# Altium schematic sheet VoltageRegulator5V.SchDoc
size A
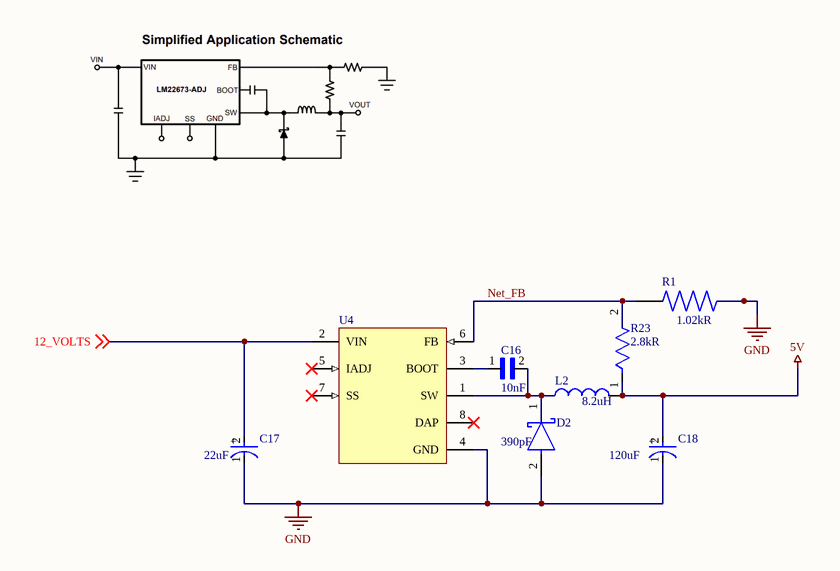
[diagram p0: VoltageRegulator5V.SchDoc]

## Parts
C16  value 10nF  [CAPC2012X100N]  (hidden comment: C0805C103F5GECAUTO)
C17  value 22uF  [FP-OS-CON-SMT-C6-MFG]  (hidden comment: 35SVF22M)
C18  Capacitance: 120uF  [FP-OS-CON-SMT-E7-MFG]  (hidden comment: 16SVPC120M)
D2  value 390pF  [FP-95401-MFG]  (hidden comment: VS-10BQ015-M3/5BT)
L2  value 8.2uH  [INDC2012X145N]  (hidden comment: CV201210-8R2K)
R1  Resistance: 1.02kR  [RESC2012X70N]  (hidden comment: ERJ-PB6B1021V)
R23  Resistance: 2.8kR  [FP-RNCP0805-MFG]  (hidden comment: RNCP0805FTD2K80)
U4  LM22673TJE-5.0/NOPB  [TJ7A_M]  (value not drawn)

## Nets
5V: C18.2(A) L2.2 R23.1
GND: C17.1(C) C18.1(C) D2.2(A) R1.2 U4.4(GND)
12_VOLTS: C17.2(A) U4.2(VIN) ; off-sheet 12_VOLTS
Net_FB: R1.1 R23.2 U4.6(FB)
NetC16_1: C16.1 U4.3(BOOT)
NetC16_2: C16.2 D2.1(C) L2.1 U4.1(SW)

Not connected (* = marked no-connect by the designer): U4 5(IADJ)* 7(SS)* 8(DAP)*

## Notes on the sheet
- (in symbol CMP-05428-000021-2) +
- (in symbol CMP-05428-000375-1) +

## Library data of the parts
C16 = C0805C103F5GECAUTO: CAP CER 0805 10NF 50V C0G 1%; Manufacturer: KEMET; Manufacturer Part Number: C0805C103F5GECAUTO7210; Package: None; Price: None; MP: C0805C103F5GECAUTO; Availability: Unavailable; Supplier 1: Digi-Key; Supplier Part Number 1: C0805C103F5GECAUTO7210-ND; RoHS: Yes; Category: Ceramic Capacitors; RoHS Compliant: Yes; ComponentLink1URL: https://api.kemet.com/component-edge/download/datasheet/C0805C103F5GECAUTO7210.pdf?src-supplier=Digi-Key; ComponentLink1Description: https://api.kemet.com/component-edge/download/datasheet/C0805C103F5GECAUTO7210.pdf?src-supplier=Digi-Key
C17 = CMP-05428-000375-1: Conductive Polymer Aluminum Solid Capacitors (OS-CON) 22uF ±20% 35V; Manufacturer: Panasonic; RoHS Compliant: Yes; Supplier 1: Arrow Electronics; Supplier Part Number 1: 35SVF22M; Manufacturer Part Number: 35SVF22M; RoHS: Yes; Category: Polymer Capacitors; Stock 1: 1750; Pricing 1: 1=0.96030, 10=0.87800, 25=0.85400, 100=0.76830, 250=0.76450, 500=0.65580, 1000=0.60660 (USD); ComponentLink1URL: http://www.farnell.com/datasheets/2283842.pdf?src-supplier=Farnell; ComponentLink1Description: http://www.farnell.com/datasheets/2283842.pdf?src-supplier=Farnell; ComponentLink2URL: https://na.industrial.panasonic.com/file-download/4311?src-supplier=Digi-Key; ComponentLink2Description: https://na.industrial.panasonic.com/file-download/4311?src-supplier=Digi-Key
C18 = CMP-05428-000021-2: Conductive Polymer Aluminum Solid Capacitors (OS-CON) 120uF ±20% 16V RADIAL SMT 8x6.9mm; Manufacturer: Panasonic; Leakage Current: 500uA; Ripple Current: 2.9A; ESR (Equivalent Series Resistance): 27mR; Polarity: Polar; Dissipation Factor: 12%; Life (Hours): 2000Hour; Lead Free: Lead Free; Voltage Rating (DC): 16V; Min Operating Temperature: -55°C; Height - Seated (Max): 0.276inch; Case/Package: Radial; REACH SVHC: No SVHC; Diameter: 8mm; Mount: Surface Mount; Package Quantity: 1000; Construction: Cylindrical; Max Operating Temperature: 105°C; Voltage: 16V; Length: 6.9mm; Tolerance: 20%; RoHS Compliant: Yes; Series: OS-CON, SVPC; Packaging: Tape and Reel; Voltage Rating: 16V; Termination: SMD/SMT; Number of Pins: 7; Ripple Current (AC): 2.9A; Height: 6.9mm; Supplier 1: RSComponents; Supplier Part Number 1: 7887618; Manufacturer Part Number: 16SVPC120M; RoHS: Yes; Category: Aluminum Electrolytic Capacitors; Stock 1: 1; Pricing 1: 2=1.66000, 10=1.54400, 20=1.42700, 50=1.19300, 100=1.02700 (USD); Reach SVHC Compliant: No; ComponentLink1URL: https://datasheet.ciiva.com/22746/1734358-22746176.pdf?src-supplier=Element14; ComponentLink1Description: https://datasheet.ciiva.com/22746/1734358-22746176.pdf?src-supplier=Element14; ComponentLink2URL: https://datasheet.ciiva.com/48542/svpc-eng-ds-48542359.pdf?src-supplier=Distrelec; ComponentLink2Description: https://datasheet.ciiva.com/48542/svpc-eng-ds-48542359.pdf?src-supplier=Distrelec; ComponentLink3URL: https://datasheet.ciiva.com/25740/1734358-25740810.pdf?src-supplier=Farnell; ComponentLink3Description: https://datasheet.ciiva.com/25740/1734358-25740810.pdf?src-supplier=Farnell
D2 = CMP-02539-000017-1: DIODE SCHOTTKY 15V 1A DO214AA; Manufacturer: Vishay; Standoff Height: 0mm; Max Surge Forward Current: 40A; Peak Reverse Current: 0.5mA; Max Junction Temp: +125°C; Max Reverse Current: 500uA; Max Forward Surge Current (Ifsm): 140A; Forward Voltage: 330mV; Element Configuration: Single; Max Repetitive Reverse Voltage: 15V; Mouser Description: VS-10BQ015 Series 15 V 1 A SMT Schottky Rectifier - SMB (DO-214AA); Device Class L1: Discrete Semiconductors; Height: 2.44mm; ComponentLink2Description: Datasheet; ComponentLink2URL: http://www.vishay.com/docs/93349/vs-10bq015m.pdf; Footprint Url: http://www.vishay.com/docs/95401/smb.pdf; Reverse Voltage: 15V; Device Class L2: Diodes; Package: 95401; Temperature Range High: +125°C; Manufacturer Part Number: VS-10BQ015-M3/5BT; Category: Diode; Device Class L3: Schottky Diodes; Temperature Range Low: -55°C; Capacitance: 390pF; RoHS: TRUE; Octopart: https://octopart.com/vs-10bq015-m3%2F5bt-vishay-39003459; Forward Current: 1A; Digikey Description: DIODE SCHOTTKY 15V 1A DO214AA; Temperature: -55°C to +125°C; Lead Free: Yes; Automotive: No; Supplier 1: RSComponents; Supplier Part Number 1: 5431601; Stock 1: 935; Pricing 1: 5=0.41200, 50=0.39000, 100=0.33000, 250=0.30800, 500=0.29000 (GBP); Mount: Surface Mount; Number of Pins: 2; Min Operating Temperature: -55°C; Max Operating Temperature: 125°C; Packaging: Tape and Reel; Average Rectified Current: 1A; Max Repetitive Reverse Voltage (Vrrm): 15V; Peak Non-Repetitive Surge Current: 140A; Max Reverse Voltage (DC): 15V; Length: 4.7mm; Width: 3.8mm; Reach SVHC Compliant: No; RoHS Compliant: Yes; ComponentLink1URL: http://uk.rs-online.com/webdocs/0791/0900766b8079100c.pdf?src-supplier=RSComponents; ComponentLink1Description: http://uk.rs-online.com/webdocs/0791/0900766b8079100c.pdf?src-supplier=RSComponents; ComponentLink3URL: http://www.mouser.com/ds/2/427/10bq015m-552901.pdf?src-supplier=Mouser; ComponentLink3Description: http://www.mouser.com/ds/2/427/10bq015m-552901.pdf?src-supplier=Mouser; ComponentLink4URL: https://media.digikey.com/pdf/Data%20Sheets/Vishay%20Semiconductors/VS-10BQ015-M3.pdf?src-supplier=Digi-Key; ComponentLink4Description: https://media.digikey.com/pdf/Data%20Sheets/Vishay%20Semiconductors/VS-10BQ015-M3.pdf?src-supplier=Digi-Key; ComponentLink5URL: http://www.produktinfo.conrad.com/datenblaetter/575000-599999/596658-da-01-en-DIODE_SCH_VS_10BQ015_M3_5BT_DO_214AA_VIS.pdf?src-supplier=Conrad; ComponentLink5Description: http://www.produktinfo.conrad.com/datenblaetter/575000-599999/596658-da-01-en-DIODE_SCH_VS_10BQ015_M3_5BT_DO_214AA_VIS.pdf?src-supplier=Conrad; ComponentLink6URL: http://www.farnell.com/datasheets/2085355.pdf?src-supplier=Element14; ComponentLink6Description: http://www.farnell.com/datasheets/2085355.pdf?src-supplier=Element14
L2 = CV201210-8R2K: Ind Chip Shielded Multi-Layer 8.2uH 10% 4MHz 45Q-Factor Ferrite 15mA 0805 T/R; Manufacturer: Bourns; DC Resistance (DCR): 1.1R; Self Resonant Frequency: 26MHz; Package: None; Price: None; MP: CV201210-8R2K; Availability: Unavailable; Supplier 1: Mouser; Supplier Part Number 1: 652-CV201210-8R2K; Manufacturer Part Number: CV201210-8R2K; RoHS: Yes; Category: Fixed Inductors; Stock 1: 12226; Pricing 1: 1=0.10000, 10=0.06300, 50=0.06300, 100=0.05100, 1000=0.03900, 10000=0.02900 (USD); Mount: Surface Mount; Case/Package: 0805; Core Material: Ferrite; Min Operating Temperature: -55°C; Max Operating Temperature: 125°C; Package Quantity: 2000; Packaging: Tape and Reel; Current Rating: 15mA; Tolerance: 10%; Shielding: Shielded; Inductance: 8.2uH; Termination: SMD/SMT; Test Frequency: 4MHz; Max DC Current: 15mA; Series: CV201210; Length: 0.079inch; Width: 1.25mm; Height: 1.25mm; Height - Seated (Max): 0.057inch; ComponentLink1URL: https://datasheet.ciiva.com/1067/cv201210-1067559.pdf?src-supplier=Digi-Key; ComponentLink1Description: https://datasheet.ciiva.com/1067/cv201210-1067559.pdf?src-supplier=Digi-Key; ComponentLink2URL: https://datasheet.ciiva.com/8516/cv201210-8516252.pdf?src-supplier=Avnet; ComponentLink2Description: https://datasheet.ciiva.com/8516/cv201210-8516252.pdf?src-supplier=Avnet
R1 = ERJ-PB6B1021V: Res SMD 1.02K Ohm 0.1% 1/4W 0805; Manufacturer: Panasonic; Max Power Dissipation: 250mW; Temperature Coefficient: 50ppm/°C; Package: None; Price: None; Value: *; MP: ERJ-PB6B1021V; Availability: Unavailable; Supplier 1: Arrow Electronics; Supplier Part Number 1: ERJ-PB6B1021V; Manufacturer Part Number: ERJ-PB6B1021V; RoHS: Yes; Category: Chip SMD Resistors; Stock 1: 4544; Pricing 1: 1=0.06400, 10=0.05410, 25=0.03880, 50=0.02800, 100=0.02780, 250=0.02750, 500=0.02730, 1000=0.02710, 3000=0.02690 (USD); Case/Package: 0805; Case Code (Metric): 2012; Case Code (Imperial): 0805; Min Operating Temperature: -55°C; Max Operating Temperature: 155°C; Packaging: Tape and Reel; Resistor Type: Thick Film; Number of Terminations: 2; Tolerance: 0.1%; Features: Automotive AEC-Q200; Length: 0.079inch; Width: 0.049inch; Height - Seated (Max): 0.028inch; ComponentLink1URL: https://industrial.panasonic.com/cdbs/www-data/pdf/RDM0000/DMM0000COL5.pdf?src-supplier=Digi-Key; ComponentLink1Description: https://industrial.panasonic.com/cdbs/www-data/pdf/RDM0000/DMM0000COL5.pdf?src-supplier=Digi-Key; ComponentLink2URL: https://industrial.panasonic.com/sa/system/files/data/download/catalog/id_fixed-resistors_e_2.pdf?src-supplier=Digi-Key; ComponentLink2Description: https://industrial.panasonic.com/sa/system/files/data/download/catalog/id_fixed-resistors_e_2.pdf?src-supplier=Digi-Key
R23 = CMP-26527-004404-1: 2.8kΩ ±1% 0.25W 0805 High Power Anti-Sulfur Thin Film Chip Resistor; Manufacturer: Stackpole Electronics; Max Power Dissipation: 250mW; Temperature Coefficient: 100ppm/°C; Case Code (Imperial): 0805; Height: 0.024inch; Mount: Surface Mount; Tolerance: 1%; Max Operating Temperature: 155°C; Packaging: Tape and Reel; Width: 0.049inch; Number of Terminations: 2; Case Code (Metric): 2012; Series: RNCP; Length: 0.079inch; Min Operating Temperature: -55°C; Resistor Type: Thin Film; RoHS Compliant: Yes; Case/Package: 0805; Features: Moisture Resistant; Supplier 1: Avnet; Supplier Part Number 1: RNCP0805FTD2K80; Manufacturer Part Number: RNCP0805FTD2K80; RoHS: Yes; Category: Chip SMD Resistors; Stock 1: 75000; Pricing 1: 25000=0.00682, 35000=0.00672, 60000=0.00653, 125000=0.00638, 250000=0.00614, 1250000=0.00600, 2500000=0.00586 (USD); ComponentLink1URL: http://www.seielect.com/Catalog/SEI-rncp.pdf?src-supplier=Digi-Key; ComponentLink1Description: http://www.seielect.com/Catalog/SEI-rncp.pdf?src-supplier=Digi-Key; ComponentLink2URL: https://www.seielect.com/catalog/SEI-Packaging.pdf?src-supplier=Digi-Key; ComponentLink2Description: https://www.seielect.com/catalog/SEI-Packaging.pdf?src-supplier=Digi-Key
U4 = CMP-0069-00312-2: 3A SIMPLE SWITCHER®, Step-Down Voltage Regulator with Adjustable Soft-Start and Current Limit, 7-pin TO-263 Thin, Pb-Free; Manufacturer: National Semiconductor; PackageTopMarking: NSUZXYTTE#*LM22673*TJ-5.0; PowerWise: N; Frequency: 500kHz; Max Input Voltage: 42V; Min Supply Voltage: 8V; Output Voltage: 5V; Number of Outputs: 1; Efficiency: 90%; Min Input Voltage: 4.5V; Synchronous Rectifier: No; Quiescent Current: 3.4mA; Output Type: Fixed; PinCount: 7; ComponentLink2Description: LM22673 Web Page; ComponentLink1URL: http://www.national.com/ds/LM/LM22673.pdf; ComponentLink3URL: http://www.national.com/packaging/folders/tj7a.html; PackageVersion: revC, Jan-2008; ComponentLink2URL: http://www.national.com/pf/LM/LM22673.html; CompType: Switcher; PackageReference: TJ7A; ComponentLink3Description: TJ7A Package Page; RoHS: Y; DatasheetVersion: Nov-2008; ComponentLink1Description: LM22673 Datasheet; RevisionNote: Component URLs added; PackageDescription: Thin TO-263, Molded, 9.85 x 10.16 x 2mm Body, 7 Lead, 1.27mm Pitch, Surface Mount; Supplier 1: Digi-Key; Supplier Part Number 1: LM22673TJE-5.0/NOPBCT-ND; Manufacturer Part Number: LM22673TJE-5.0/NOPB; Category: Voltage Regulators - Switching; Stock 1: 248; Pricing 1: 1=6.04000, 10=5.42100, 25=5.12520, 100=4.44200 (USD); Mount: Surface Mount; Case/Package: TO-263; Number of Pins: 7; Weight: 0.01lb; Contact Plating: Tin; Min Operating Temperature: -40°C; Max Operating Temperature: 125°C; Max Output Current: 3A; Max Supply Voltage: 42V; Output Current: 3A; Packaging: Tape and Reel; Switching Frequency: 500kHz; Package Quantity: 250; Nominal Output Voltage: 5V; Max Output Voltage: 5V; Termination: SMD/SMT; Series: SIMPLE SWITCHER®; Length: 10.16mm; Width: 9.85mm; Height: 2mm; Radiation Hardening: No; Reach SVHC Compliant: No SVHC; Lead Free: Lead Free; RoHS Compliant: Yes; ComponentLink4URL: https://datasheet.ciiva.com/7994/1808298-7994560.pdf?src-supplier=Element14; ComponentLink4Description: https://datasheet.ciiva.com/7994/1808298-7994560.pdf?src-supplier=Element14; ComponentLink5URL: https://datasheet.ciiva.com/25627/0900766b810fa302-25627441.pdf?src-supplier=RSComponents; ComponentLink5Description: https://datasheet.ciiva.com/25627/0900766b810fa302-25627441.pdf?src-supplier=RSComponents; ComponentLink6URL: https://datasheet.ciiva.com/6596/lm22673-6596911.pdf?src-supplier=Digi-Key; ComponentLink6Description: https://datasheet.ciiva.com/6596/lm22673-6596911.pdf?src-supplier=Digi-Key; ComponentLink7URL: https://datasheet.ciiva.com/6596/lm22673-6596909.pdf?src-supplier=Digi-Key; ComponentLink7Description: https://datasheet.ciiva.com/6596/lm22673-6596909.pdf?src-supplier=Digi-Key; ComponentLink8URL: https://datasheet.ciiva.com/3221/lm22673-3221549.pdf?src-supplier=Avnet; ComponentLink8Description: https://datasheet.ciiva.com/3221/lm22673-3221549.pdf?src-supplier=Avnet